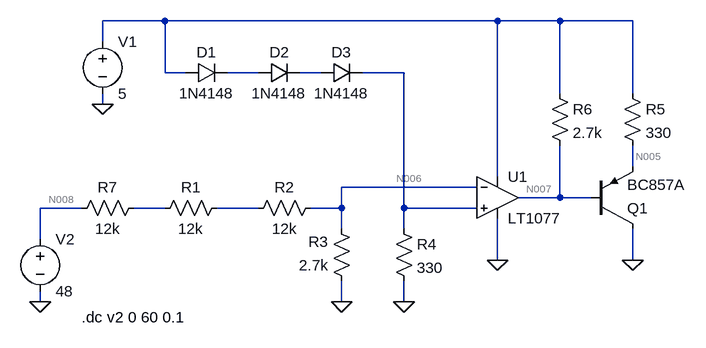
[diagram p0: schematic 48v_detector.asc]
48v_detector.asc, the LTspice schematic file:
Version 4
SHEET 1 880 680
WIRE -496 48 -592 48
WIRE 16 48 -496 48
WIRE 112 48 16 48
WIRE 224 48 112 48
WIRE -592 80 -592 48
WIRE -496 128 -496 48
WIRE -464 128 -496 128
WIRE -352 128 -400 128
WIRE -256 128 -288 128
WIRE -128 128 -192 128
WIRE 112 160 112 48
WIRE 224 160 224 48
WIRE -592 176 -592 160
WIRE 224 272 224 240
WIRE 16 288 16 48
WIRE -16 304 -224 304
WIRE 112 320 112 240
WIRE 112 320 48 320
WIRE 160 320 112 320
WIRE -624 336 -688 336
WIRE -496 336 -544 336
WIRE -352 336 -416 336
WIRE -224 336 -224 304
WIRE -224 336 -272 336
WIRE -128 336 -128 128
WIRE -16 336 -128 336
WIRE -224 368 -224 336
WIRE -128 368 -128 336
WIRE -688 384 -688 336
WIRE 16 416 16 352
WIRE 224 416 224 368
WIRE -688 480 -688 464
WIRE -224 480 -224 448
WIRE -128 480 -128 448
FLAG -592 176 0
FLAG -688 480 0
FLAG 16 416 0
FLAG -224 480 0
FLAG -128 480 0
FLAG 224 416 0
SYMBOL voltage -592 64 R0
WINDOW 123 0 0 Left 2
WINDOW 39 0 0 Left 2
SYMATTR InstName V1
SYMATTR Value 5
SYMBOL voltage -688 368 R0
WINDOW 123 0 0 Left 2
WINDOW 39 0 0 Left 2
SYMATTR InstName V2
SYMATTR Value 48
SYMBOL pnp 160 368 M180
SYMATTR InstName Q1
SYMATTR Value BC857A
SYMBOL Opamps\\LT1077 16 256 R0
SYMATTR InstName U1
SYMBOL res -400 320 R90
WINDOW 0 0 56 VBottom 2
WINDOW 3 32 56 VTop 2
SYMATTR InstName R1
SYMATTR Value 12k
SYMBOL res -256 320 R90
WINDOW 0 0 56 VBottom 2
WINDOW 3 32 56 VTop 2
SYMATTR InstName R2
SYMATTR Value 12k
SYMBOL res -208 464 R180
WINDOW 0 36 76 Left 2
WINDOW 3 36 40 Left 2
SYMATTR InstName R3
SYMATTR Value 2.7k
SYMBOL res -144 352 R0
SYMATTR InstName R4
SYMATTR Value 330
SYMBOL res 208 144 R0
SYMATTR InstName R5
SYMATTR Value 330
SYMBOL diode -464 144 R270
WINDOW 0 32 32 VTop 2
WINDOW 3 0 32 VBottom 2
SYMATTR InstName D1
SYMATTR Value 1N4148
SYMBOL diode -352 144 R270
WINDOW 0 32 32 VTop 2
WINDOW 3 0 32 VBottom 2
SYMATTR InstName D2
SYMATTR Value 1N4148
SYMBOL diode -256 144 R270
WINDOW 0 32 32 VTop 2
WINDOW 3 0 32 VBottom 2
SYMATTR InstName D3
SYMATTR Value 1N4148
SYMBOL res 96 144 R0
SYMATTR InstName R6
SYMATTR Value 2.7k
SYMBOL res -528 320 R90
WINDOW 0 0 56 VBottom 2
WINDOW 3 32 56 VTop 2
SYMATTR InstName R7
SYMATTR Value 12k
TEXT -624 504 Left 2 !.dc v2 0 60 0.1

The netlist it stands for:
* 48v_detector.asc
V1 N001 0 5
V2 N008 0 48
Q1 0 N007 N005 0 BC857A
XU1 N004 N006 N001 0 N007 LT1077  ; pins In+ In- V+ V- OUT
R1 N010 N009 12k
R2 N006 N010 12k
R3 0 N006 2.7k
R4 N004 0 330
R5 N001 N005 330
D1 N001 N002 1N4148
D2 N002 N003 1N4148
D3 N003 N004 1N4148
R6 N001 N007 2.7k
R7 N009 N008 12k
.model D D
.lib standard.dio
.model NPN NPN
.model PNP PNP
.lib standard.bjt
.dc v2 0 60 0.1
.backanno
.end

* Results of the author's LTspice run, read from the files saved beside the schematic
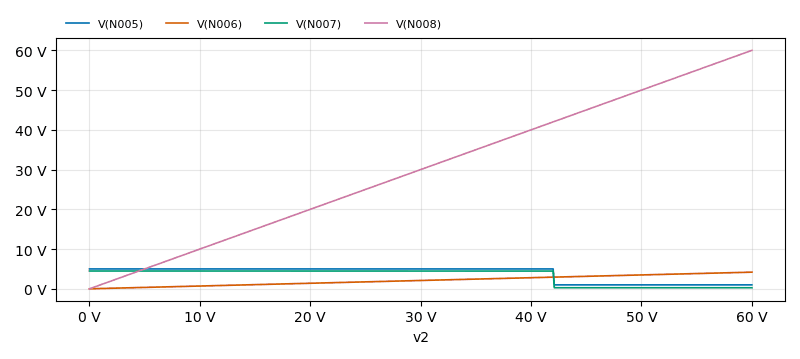
[diagram p1: DC transfer characteristic of 48v_detector.asc, plotted from the saved traces]
* DC transfer characteristic, 1 run:
*   V(N005): 4.998 V at v2=0 V, 987.9 mV at v2=60 V, min 987.9 mV, max 4.998 V
*   V(N006): 24.2 µV at v2=0 V, 4.186 V at v2=60 V, min 24.2 µV, max 4.186 V
*   V(N007): 4.479 V at v2=0 V, 262.4 mV at v2=60 V, min 262.4 mV, max 4.479 V
*   V(N008): 0 V at v2=0 V, 60 V at v2=60 V, min 0 V, max 60 V